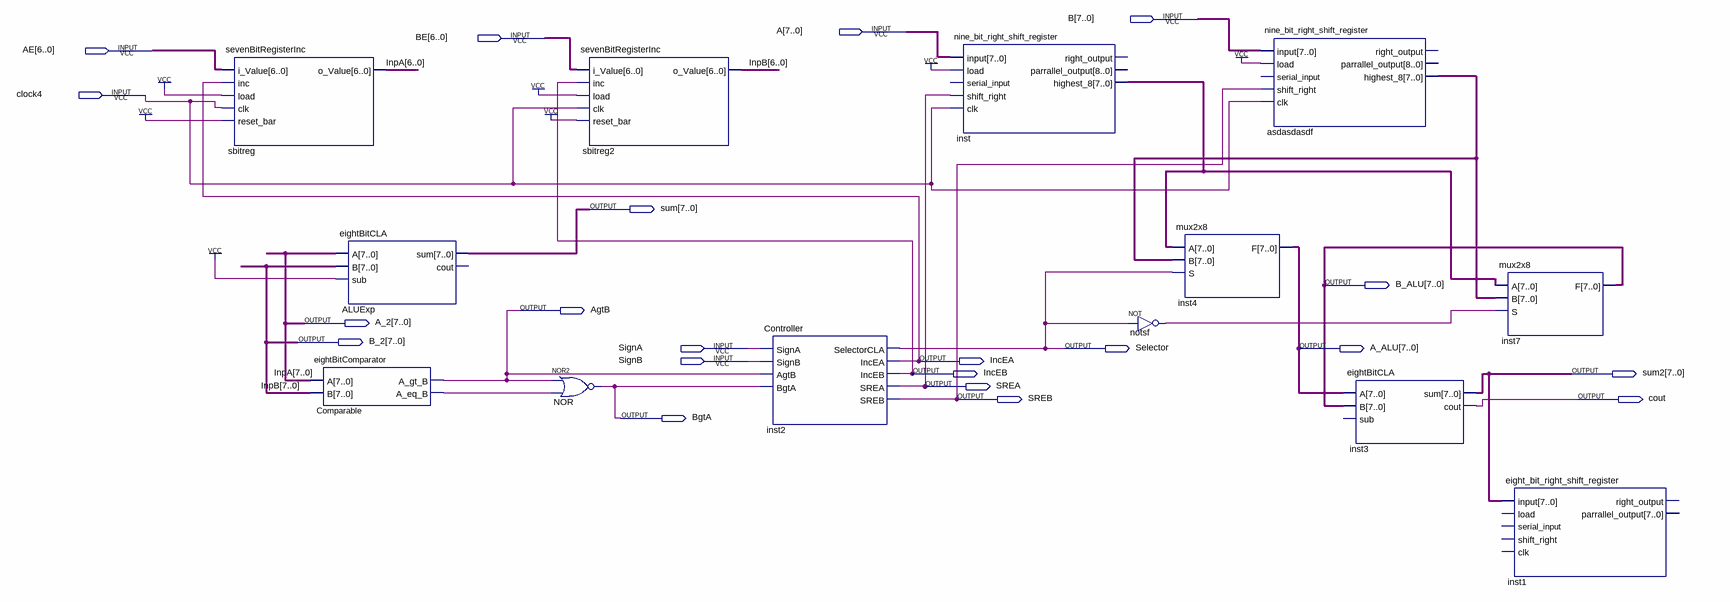
[diagram p0: schematic sheet]
// Quartus schematic Adder.bdf as structural Verilog: 13 symbols, 21 pins
module Adder (
  input  [7:0] B,
  input  [7:0] A,
  input  [6:0] BE,
  input  [6:0] AE,
  input  clock4,
  input  SignA,
  input  SignB,
  output [7:0] sum,
  output [7:0] B_ALU,
  output AgtB,
  output [7:0] A_2,
  output [7:0] B_2,
  output Selector,
  output [7:0] A_ALU,
  output IncEA,
  output IncEB,
  output [7:0] sum2,
  output SREA,
  output SREB,
  output cout,
  output BgtA
);

  wire Comparable_a_eq_b, notsf_out;
  wire [7:0] asdasdasdf_highest_8, inst_highest_8;

  sevenBitRegisterInc sbitreg (
    .i_Value(AE), .inc(IncEA), .load(1'b1), .clk(clock4), .reset_bar(1'b1), .o_Value(A_2[6:0]));
  eightBitCLA ALUExp (.A(A_2), .B(B_2), .sub(1'b1), .sum(sum));  // open: cout
  eightBitComparator Comparable (.A(A_2), .B(B_2), .A_gt_B(AgtB), .A_eq_B(Comparable_a_eq_b));
  sevenBitRegisterInc sbitreg2 (
    .i_Value(BE), .inc(IncEB), .load(1'b1), .clk(clock4), .reset_bar(1'b1), .o_Value(B_2[6:0]));
  nor NOR (BgtA, AgtB, Comparable_a_eq_b);
  Controller inst2 (
    .SignA(SignA), .SignB(SignB), .AgtB(AgtB), .BgtA(BgtA), .SelectorCLA(Selector), .IncEA(IncEA),
    .IncEB(IncEB), .SREA(SREA), .SREB(SREB));
  nine_bit_right_shift_register inst (
    .\input (A), .load(1'b1), .shift_right(SREA), .clk(clock4), .highest_8(inst_highest_8));  // open: serial_input, right_output, parrallel_output
  not notsf (notsf_out, Selector);
  mux2x8 inst4 (.A(inst_highest_8), .B(asdasdasdf_highest_8), .S(Selector), .F(A_ALU));
  nine_bit_right_shift_register asdasdasdf (
    .\input (B), .load(1'b1), .shift_right(SREB), .clk(clock4), .highest_8(asdasdasdf_highest_8));  // open: serial_input, right_output, parrallel_output
  eightBitCLA inst3 (.A(A_ALU), .B(B_ALU), .sum(sum2), .cout(cout));  // open: sub
  mux2x8 inst7 (.A(inst_highest_8), .B(asdasdasdf_highest_8), .S(notsf_out), .F(B_ALU));
  eight_bit_right_shift_register inst1 (.\input (sum2));  // open: load, serial_input, shift_right, clk, right_output, parrallel_output

  // Other names for the same wires on the sheet: InpA[7:0] = A_2; InpB[7:0] = B_2
endmodule
